# EAGLE design tix_display (EAGLE 7.3.0)
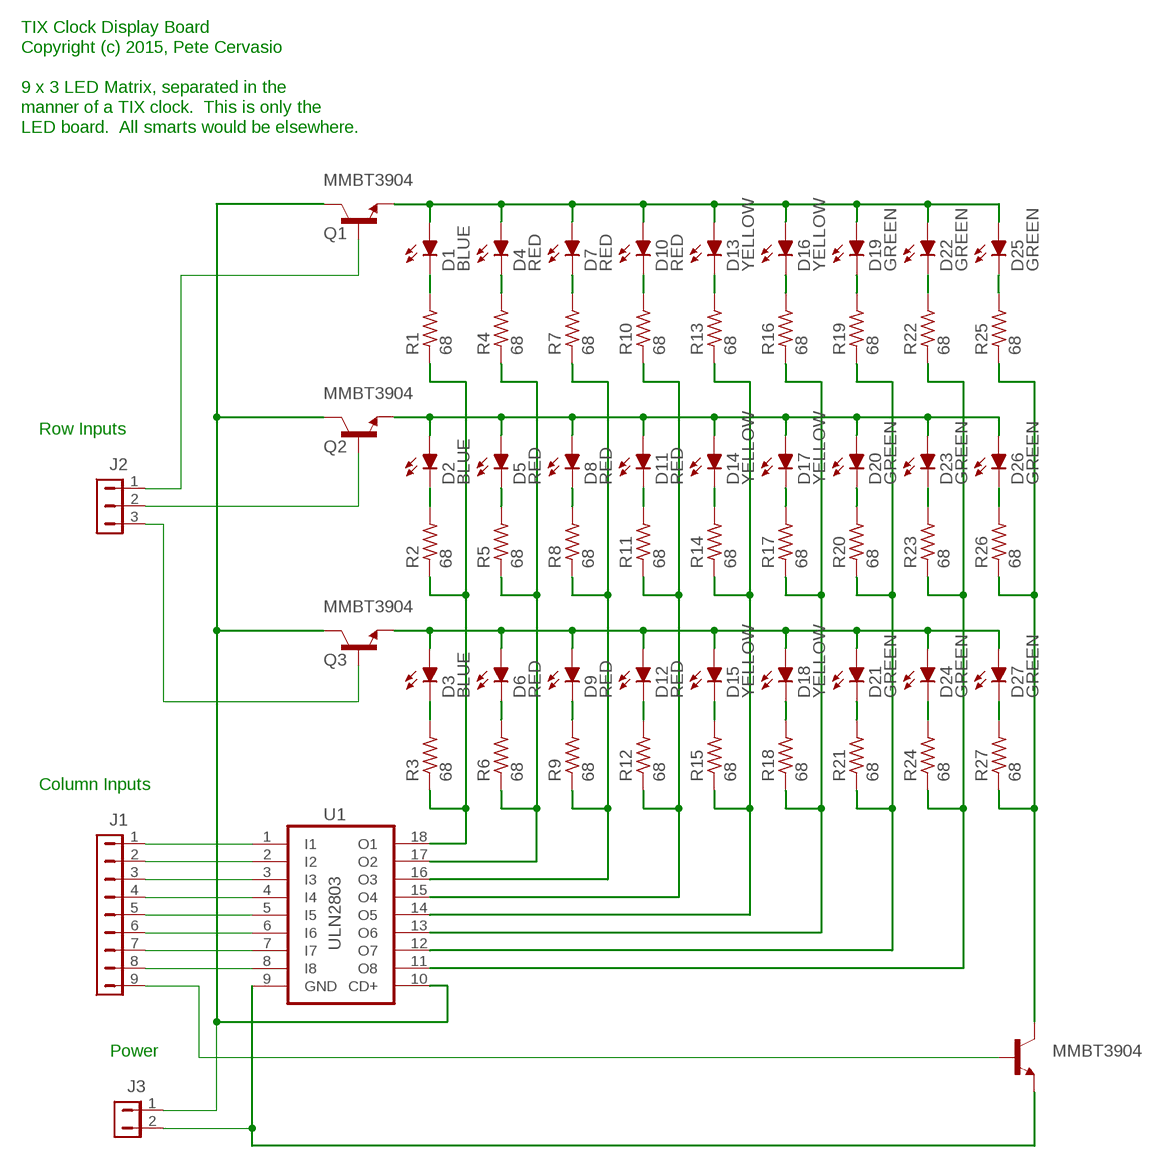
[diagram p0: schematic, sheet 1]

## Parts
D1  BLUE  AA2214SURSK  [AA2214SURSK]
D2  BLUE  AA2214SURSK  [AA2214SURSK]
D3  BLUE  AA2214SURSK  [AA2214SURSK]
D4  RED  AA2214SURSK  [AA2214SURSK]
D5  RED  AA2214SURSK  [AA2214SURSK]
D6  RED  AA2214SURSK  [AA2214SURSK]
D7  RED  AA2214SURSK  [AA2214SURSK]
D8  RED  AA2214SURSK  [AA2214SURSK]
D9  RED  AA2214SURSK  [AA2214SURSK]
D10  RED  AA2214SURSK  [AA2214SURSK]
D11  RED  AA2214SURSK  [AA2214SURSK]
D12  RED  AA2214SURSK  [AA2214SURSK]
D13  YELLOW  AA2214SURSK  [AA2214SURSK]
D14  YELLOW  AA2214SURSK  [AA2214SURSK]
D15  YELLOW  AA2214SURSK  [AA2214SURSK]
D16  YELLOW  AA2214SURSK  [AA2214SURSK]
D17  YELLOW  AA2214SURSK  [AA2214SURSK]
D18  YELLOW  AA2214SURSK  [AA2214SURSK]
D19  GREEN  AA2214SURSK  [AA2214SURSK]
D20  GREEN  AA2214SURSK  [AA2214SURSK]
D21  GREEN  AA2214SURSK  [AA2214SURSK]
D22  GREEN  AA2214SURSK  [AA2214SURSK]
D23  GREEN  AA2214SURSK  [AA2214SURSK]
D24  GREEN  AA2214SURSK  [AA2214SURSK]
D25  GREEN  AA2214SURSK  [AA2214SURSK]
D26  GREEN  AA2214SURSK  [AA2214SURSK]
D27  GREEN  AA2214SURSK  [AA2214SURSK]
J1  MTA09-100  [MTA09-100]
J2  MTA03-100  [MTA03-100]
J3  MTA02-100  [MTA02-100]
Q1  MMBT3904  [SOT23-BEC]
Q2  MMBT3904  [SOT23-BEC]
Q3  MMBT3904  [SOT23-BEC]
Q4  MMBT3904  [SOT23-BEC]
R1  68  R-US_M0805  [M0805]
R2  68  R-US_M0805  [M0805]
R3  68  R-US_M0805  [M0805]
R4  68  R-US_M0805  [M0805]
R5  68  R-US_M0805  [M0805]
R6  68  R-US_M0805  [M0805]
R7  68  R-US_M0805  [M0805]
R8  68  R-US_M0805  [M0805]
R9  68  R-US_M0805  [M0805]
R10  68  R-US_M0805  [M0805]
R11  68  R-US_M0805  [M0805]
R12  68  R-US_M0805  [M0805]
R13  68  R-US_M0805  [M0805]
R14  68  R-US_M0805  [M0805]
R15  68  R-US_M0805  [M0805]
R16  68  R-US_M0805  [M0805]
R17  68  R-US_M0805  [M0805]
R18  68  R-US_M0805  [M0805]
R19  68  R-US_M0805  [M0805]
R20  68  R-US_M0805  [M0805]
R21  68  R-US_M0805  [M0805]
R22  68  R-US_M0805  [M0805]
R23  68  R-US_M0805  [M0805]
R24  68  R-US_M0805  [M0805]
R25  68  R-US_M0805  [M0805]
R26  68  R-US_M0805  [M0805]
R27  68  R-US_M0805  [M0805]
U1  ULN2803  ULN2803AFW  [SO18W]

## Nets
GND: J3.2 Q4.E U1.9(GND)
LEDCOL1: R1.1 R2.1 R3.1 U1.18(O1)
LEDCOL2: R4.1 R5.1 R6.1 U1.17(O2)
LEDCOL3: R7.1 R8.1 R9.1 U1.16(O3)
LEDCOL4: R10.1 R11.1 R12.1 U1.15(O4)
LEDCOL5: R13.1 R14.1 R15.1 U1.14(O5)
LEDCOL6: R16.1 R17.1 R18.1 U1.13(O6)
LEDCOL7: R19.1 R20.1 R21.1 U1.12(O7)
LEDCOL8: R22.1 R23.1 R24.1 U1.11(O8)
LEDCOL9: Q4.C R25.1 R26.1 R27.1
N$1: D1.A D4.A D7.A D10.A D13.A D16.A D19.A D22.A D25.A Q1.E
N$2: D2.A D5.A D8.A D11.A D14.A D17.A D20.A D23.A D26.A Q2.E
N$3: D3.A D6.A D9.A D12.A D15.A D18.A D21.A D24.A D27.A Q3.E
N$13: D3.C R3.2
N$14: D27.C R27.2
N$15: J2.1 Q1.B
N$16: D24.C R24.2
N$17: J2.2 Q2.B
N$18: D21.C R21.2
N$19: D18.C R18.2
N$20: D15.C R15.2
N$21: D12.C R12.2
N$22: D9.C R9.2
N$23: D6.C R6.2
N$24: D2.C R2.2
N$25: D5.C R5.2
N$26: D8.C R8.2
N$27: D11.C R11.2
N$28: D14.C R14.2
N$29: D17.C R17.2
N$30: D20.C R20.2
N$31: D23.C R23.2
N$32: D26.C R26.2
N$33: D1.C R1.2
N$34: D25.C R25.2
N$35: D22.C R22.2
N$36: D19.C R19.2
N$37: D16.C R16.2
N$38: D13.C R13.2
N$39: D10.C R10.2
N$40: D7.C R7.2
N$41: D4.C R4.2
N$43: J2.3 Q3.B
N$44: J1.1 U1.1(I1)
N$45: J1.2 U1.2(I2)
N$46: J1.3 U1.3(I3)
N$47: J1.4 U1.4(I4)
N$48: J1.5 U1.5(I5)
N$49: J1.6 U1.6(I6)
N$50: J1.7 U1.7(I7)
N$51: J1.8 U1.8(I8)
N$52: J1.9 Q4.B
VCC: J3.1 Q1.C Q2.C Q3.C U1.10(CD+)

## Notes on the sheet
- TIX Clock Display Board
  Copyright (c) 2015, Pete Cervasio
  
  9 x 3 LED Matrix, separated in the
  manner of a TIX clock.  This is only the
  LED board.  All smarts would be elsewhere.
- Row Inputs
- Column Inputs
- Power

## Library data of the parts
D1-D27 = led:AA2214SURSK: SURFACE MOUNT LED
J1 = con-amp:MTA09: AMP connector
J2 = con-amp:MTA03: AMP connector
J3 = con-amp:MTA02: AMP connector
Q1-Q4 = transistor-npn:MMBT3904*: NPN TRANSISTOR
R1-R27 = rcl:R-US_: RESISTOR, American symbol
U1 = uln-udn:ULN2803A: DRIVER ARRAY

## Board
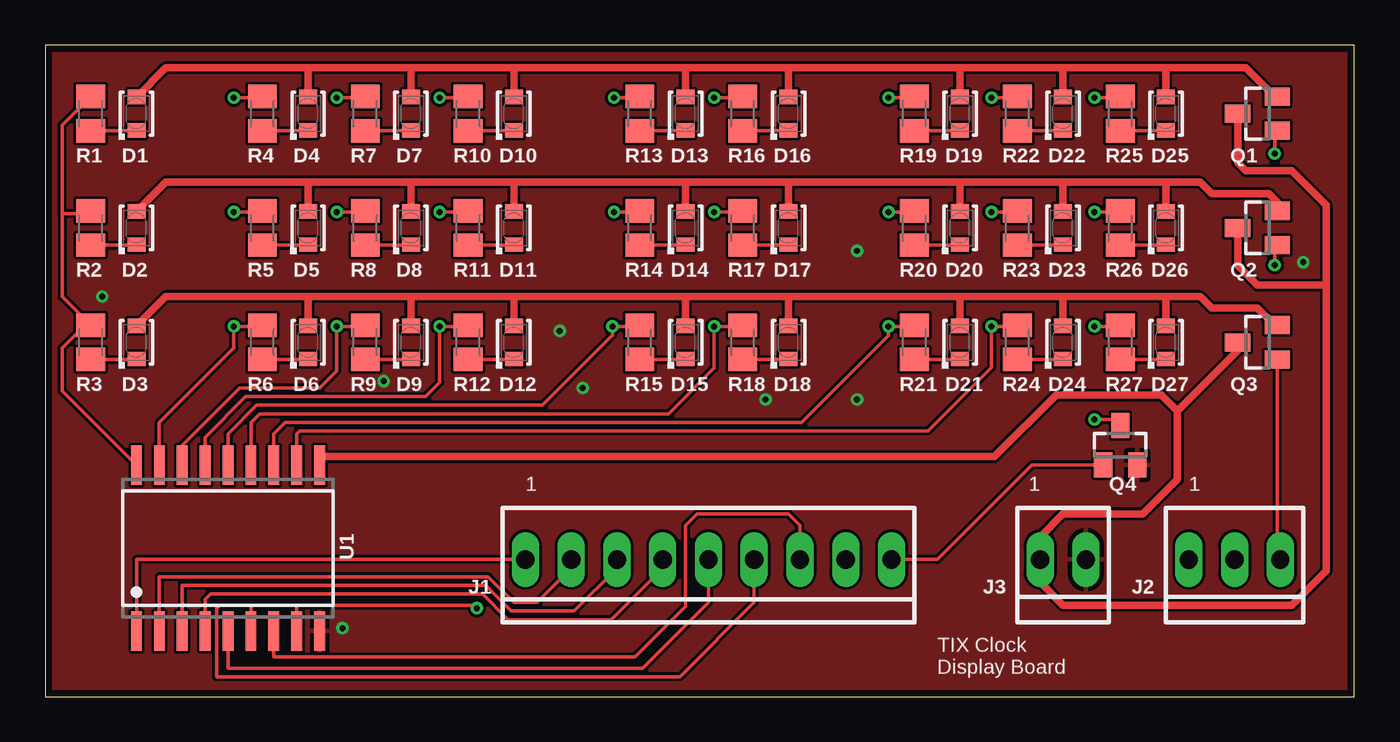
[diagram p1: board, top side]
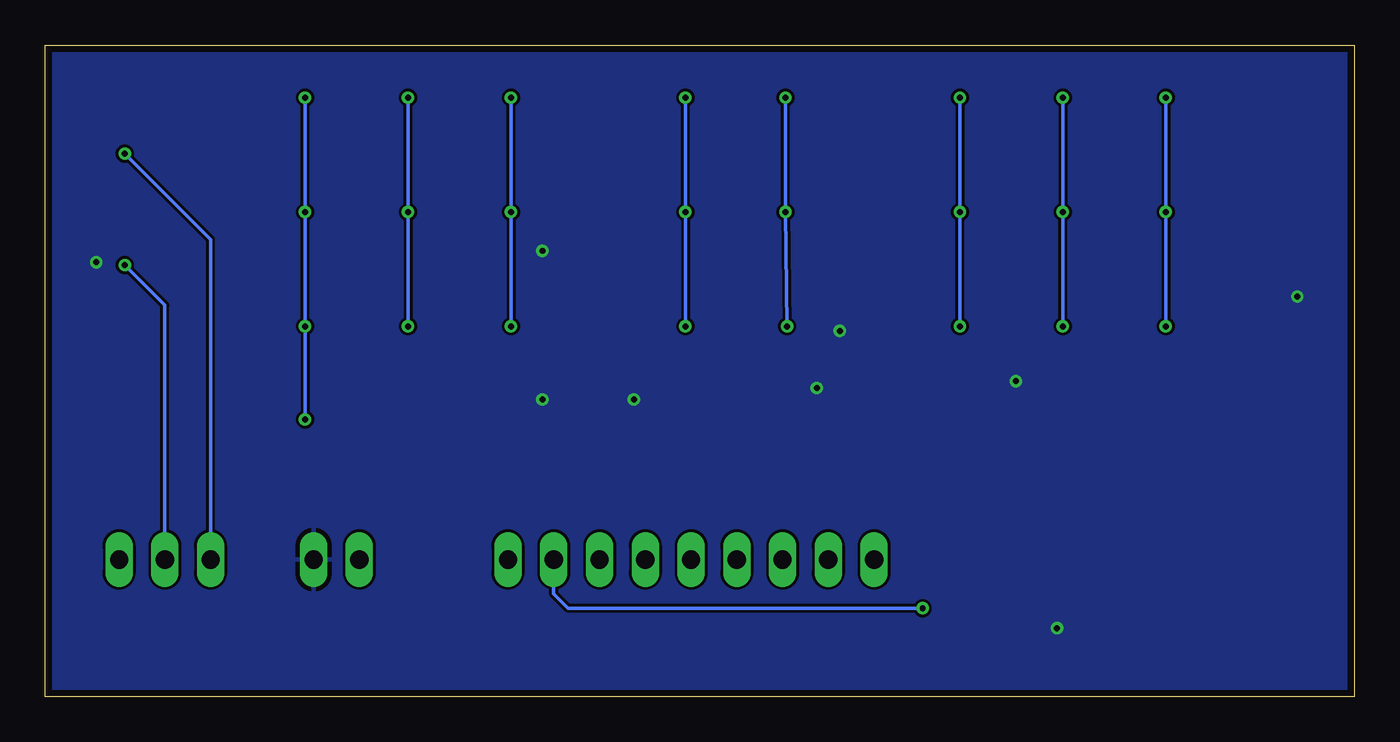
[diagram p2: board, bottom side, seen from below]

Size 72.69 x 36.2 mm. Coordinates in mm from the lower left corner, seen from the top.
Outline: 0,0 72.69,0 72.69,36.19 0,36.2 0,0
Copper layers (1*16): Top 0.0356mm / dielectric 1.5011mm / Bottom 0.0356mm
Design rules "LaenPCBOrder": minimum track width 6mil, minimum drill 13mil, track to track 6mil, track to pad 6mil, pad to pad 6mil, via to via 6mil, smd to smd 6mil, copper to edge 15mil, drill to drill 6mil, minimum pad ring 7mil, minimum via ring 7mil, stop-mask expansion 3mil, vias tented up to drill 0mil, thermal gap 10mil

### Footprints (pad centres in the part's own frame; a part is rotated, then mirrored left to right if it is on the bottom)
AA2214SURSK = smd 0.8 x 1: A -0.925,0; C 0.925,0
MTA09-100 = drill 1.016 long: 1 10.16,0; 2 7.62,0; 3 5.08,0; 4 2.54,0; 5 0,0; 6 -2.54,0; 7 -5.08,0; 8 -7.62,0; 9 -10.16,0
MTA03-100 = drill 1.016 long: 1 2.54,0; 2 0,0; 3 -2.54,0
MTA02-100 = drill 1.016 long: 1 1.27,0; 2 -1.27,0
SOT23-BEC = smd 1 x 1.4: B -0.95,-1.1; C 0,1.1; E 0.95,-1.1
M0805 = smd 1.3 x 1.6: 1 -0.95,0; 2 0.95,0
SO18W = smd 0.6 x 2.2: 1 -5.08,-4.6; 2 -3.81,-4.6; 3 -2.54,-4.6; 4 -1.27,-4.6; 5 0,-4.6; 6 1.27,-4.6; 7 2.54,-4.6; 8 3.81,-4.6; 9 5.08,-4.6; 10 5.08,4.6; 11 3.81,4.6; 12 2.54,4.6; 13 1.27,4.6; 14 0,4.6; 15 -1.27,4.6; 16 -2.54,4.6; 17 -3.81,4.6; 18 -5.08,4.6

### Placement (x,y rotation side)
D1  5.08,32.38 270 top
D2  5.08,26.04 270 top
D3  5.08,19.68 270 top
D4  14.61,32.38 270 top
D5  14.61,26.04 270 top
D6  14.61,19.68 270 top
D7  20.32,32.38 270 top
D8  20.32,26.04 270 top
D9  20.32,19.68 270 top
D10  26.04,32.38 270 top
D11  26.04,26.04 270 top
D12  26.04,19.68 270 top
D13  35.56,32.38 270 top
D14  35.56,26.04 270 top
D15  35.56,19.68 270 top
D16  41.27,32.38 270 top
D17  41.27,26.04 270 top
D18  41.27,19.68 270 top
D19  50.8,32.38 270 top
D20  50.8,26.04 270 top
D21  50.8,19.68 270 top
D22  56.52,32.38 270 top
D23  56.52,26.04 270 top
D24  56.52,19.68 270 top
D25  62.23,32.38 270 top
D26  62.23,26.04 270 top
D27  62.23,19.68 270 top
J1  36.83,7.62 180 top
J2  66.04,7.62 180 top
J3  56.52,7.62 180 top
Q1  67.31,32.38 90 top
Q2  67.31,26.04 90 top
Q3  67.31,19.68 90 top
Q4  59.69,13.97 0 top
R1  2.54,32.38 270 top
R2  2.54,26.04 270 top
R3  2.54,19.68 270 top
R4  12.06,32.38 270 top
R5  12.06,26.04 270 top
R6  12.06,19.68 270 top
R7  17.78,32.38 270 top
R8  17.78,26.04 270 top
R9  17.78,19.68 270 top
R10  23.5,32.38 270 top
R11  23.5,26.04 270 top
R12  23.5,19.68 270 top
R13  33.02,32.38 270 top
R14  33.02,26.04 270 top
R15  33.02,19.68 270 top
R16  38.73,32.38 270 top
R17  38.73,26.04 270 top
R18  38.73,19.68 270 top
R19  48.26,32.38 270 top
R20  48.26,26.04 270 top
R21  48.26,19.68 270 top
R22  53.98,32.38 270 top
R23  53.98,26.04 270 top
R24  53.98,19.68 270 top
R25  59.69,32.38 270 top
R26  59.69,26.04 270 top
R27  59.69,19.68 270 top
U1  10.16,8.26 0 top

### Tracks (layer width: path | path; a pad name or v marks a point on that pad's centre or on a via)
GND  (via drill 0.33)
  other vias: 16.51,3.81 45.09,16.51 45.09,24.77 69.85,24.13 40.01,16.51 29.84,17.14 28.57,20.32 3.17,22.23 18.8,17.53
  pour Bottom: 0,36.2 72.39,36.2 72.39,0 0,0
  pour Top: 0,36.2 72.39,36.2 72.39,0 0,0
LEDCOL1
  Top 0.203: 0.95,26.83 0.95,22.23 R3.1 | 0.95,26.83 2.54,26.83 R2.1 | 0.95,26.83 0.95,31.75 R1.1 2.54,33.18 | U1.18 0.95,16.99 0.95,19.37 1.91,20.32 2.23,20.32 R3.1 | 2.54,20.48 R3.1
LEDCOL2  (via drill 0.33)
  Top 0.203: U1.17 6.35,15.24 10.48,19.37 v10.48,20.57 11.68,20.57 R6.1 11.75,20.32 | v10.48,33.27 11.43,33.27 R4.1 | v10.48,26.92 11.43,26.92 R5.1
  Bottom 0.203: v10.48,33.27 v10.48,26.92 v10.48,20.57
LEDCOL3  (via drill 0.33)
  Top 0.203: 17.62,27.15 R8.1 | 17.78,33.18 R7.1 17.27,33.27 v16.19,33.27 | 17.78,20.48 R9.1 | R9.1 | 17.72,26.92 R8.1 | U1.16 7.62,13.97 10.79,17.14 15.24,17.14 16.19,18.1 v16.19,20.57 17.27,20.57 R9.1 | v16.19,26.92 17.27,26.92 R8.1
  Bottom 0.203: v16.19,33.27 v16.19,26.92 v16.19,20.57
LEDCOL4  (via drill 0.33)
  Top 0.203: 23.34,27.15 R11.1 23.43,26.92 v21.91,26.92 | U1.15 8.89,14.41 11.14,16.67 21.11,16.67 21.91,17.46 v21.91,20.57 22.86,20.57 R12.1 | 23.5,20.48 R12.1 | R12.1 | v21.91,33.27 23.11,33.27 R10.1
  Bottom 0.203: v21.91,33.27 v21.91,26.92 v21.91,20.57
LEDCOL5  (via drill 0.33)
  Top 0.203: R15.1 32.51,20.57 v31.5,20.57 31.5,20.07 31.49,20.07 27.62,16.19 11.75,16.19 10.16,14.61 U1.14 | 33.02,33.18 R13.1 32.51,33.27 v31.59,33.27 | v31.59,26.92 32.51,26.92 R14.1
  Bottom 0.203: v31.5,20.57 v31.59,26.92 v31.59,33.27
LEDCOL6  (via drill 0.33)
  Top 0.203: R18.1 38.1,20.57 v37.15,20.57 37.15,18.26 34.61,15.72 11.91,15.72 11.43,15.24 U1.13 | v37.15,33.27 38.1,33.27 R16.1 | v37.15,26.92 38.1,26.92 R17.1
  Bottom 0.203: v37.15,20.57 v37.15,26.92 v37.15,33.27
LEDCOL7  (via drill 0.33)
  Top 0.203: R21.1 47.75,20.57 v46.83,20.57 46.83,20.07 42.01,15.24 13.34,15.24 12.7,14.61 U1.12 | v46.83,33.27 47.75,33.27 R19.1 | v46.83,26.92 47.75,26.92 R20.1
  Bottom 0.203: v46.83,20.57 v46.83,26.92 v46.83,33.27
LEDCOL8  (via drill 0.33)
  Top 0.203: 53.66,20.95 R24.1 53.34,20.57 v52.55,20.57 52.55,18.29 49.02,14.76 14.13,14.76 13.97,14.61 U1.11 | v52.55,33.27 53.34,33.27 R22.1 | v52.55,26.92 53.34,26.92 R23.1
  Bottom 0.203: v52.55,20.57 v52.55,26.92 v52.55,33.27
LEDCOL9  (via drill 0.33)
  Top 0.203: v58.26,15.4 59.37,15.4 Q4.C | 59.69,20.48 R27.1 58.93,20.57 v58.26,20.57 | 59.69,26.83 R26.1 59.18,26.92 v58.26,26.92 | 59.69,33.18 R25.1 59.18,33.27 v58.26,33.27
  Bottom 0.203: v58.26,15.4 v58.26,20.57 v58.26,26.92 v58.26,33.27
N$1
  Top 0.203: 5.08,33.34 D1.A | 14.61,33.34 D4.A | 20.32,33.34 D7.A | 26.04,33.34 D10.A
  Top 0.406: Q1.E 68.27,33.34 66.67,34.92 62.23,34.92 | 62.23,34.92 56.52,34.92 | 56.52,34.92 50.8,34.92 | 50.8,34.92 41.27,34.92 | 41.27,34.92 35.56,34.92 | 35.56,34.92 26.04,34.92 | 26.04,34.92 20.32,34.92 | 20.32,34.92 14.61,34.92 | 14.61,34.92 6.7,34.92 D1.A | D4.A 14.61,34.92 | D7.A 20.32,34.92 | D10.A 26.04,34.92 | D13.A 35.56,34.92 | D16.A 41.27,34.92 | D19.A 50.8,34.92 | D22.A 56.52,34.92 | D25.A 62.23,34.92
N$2
  Top 0.406: 62.23,28.57 64.14,28.57 64.77,27.94 67.94,27.94 68.41,27.48 Q2.E | 62.23,28.57 56.52,28.57 | 56.52,28.57 50.8,28.57 | 50.8,28.57 41.27,28.57 | D26.A 62.23,28.57 | D23.A 56.52,28.57 | D20.A 50.8,28.57 | D17.A 41.27,28.57 | 41.27,28.57 35.56,28.57 | 35.56,28.57 26.04,28.57 | 26.04,28.57 20.32,28.57 | 20.32,28.57 14.61,28.57 | 14.61,28.57 6.7,28.57 D2.A | D14.A 35.56,28.57 | D11.A 26.04,28.57 | D8.A 20.32,28.57 | D5.A 14.61,28.57
N$3
  Top 0.203: 35.56,20.64 D15.A
  Top 0.406: Q3.E 68.27,20.64 67.31,21.59 64.77,21.59 64.14,22.23 62.23,22.23 | 62.23,22.23 56.52,22.23 | 56.52,22.23 50.8,22.23 | 50.8,22.23 41.27,22.23 | 41.27,22.23 35.56,22.23 | 35.56,22.23 26.04,22.23 | 26.04,22.23 20.32,22.23 | 20.32,22.23 14.61,22.23 | 14.61,22.23 6.7,22.23 D3.A | D6.A 14.61,22.23 | D9.A 20.32,22.23 | D12.A 26.04,22.23 | D15.A 35.56,22.23 | D18.A 41.27,22.23 | D21.A 50.8,22.23 | D24.A 56.52,22.23 | D27.A 62.23,22.23
N$13
  Top 0.203: D3.C 5.08,18.73 R3.2
N$14
  Top 0.203: D27.C 62.23,18.73 R27.2
N$15  (via drill 0.33)
  Top 0.203: v68.26,30.16 68.26,31.43 Q1.B
  Bottom 0.203: v68.26,30.16 63.5,25.4 J2.1
N$16
  Top 0.203: D24.C 56.52,18.73 R24.2
N$17  (via drill 0.33)
  Top 0.203: v68.26,23.97 68.26,25.08 Q2.B
  Bottom 0.203: v68.26,23.97 66.04,21.75 J2.2
N$18
  Top 0.203: D21.C 50.8,18.73 R21.2
N$19
  Top 0.203: D18.C 41.27,18.73 R18.2
N$20
  Top 0.203: D15.C 35.56,18.73 R15.2
N$21
  Top 0.203: D12.C 26.04,18.73 R12.2
N$22
  Top 0.203: D9.C 20.32,18.73 R9.2
N$23
  Top 0.203: D6.C 14.61,18.73 R6.2
N$24
  Top 0.203: D2.C 5.08,25.08 R2.2
N$25
  Top 0.203: D5.C 14.61,25.08 R5.2
N$26
  Top 0.203: D8.C 20.32,25.08 R8.2
N$27
  Top 0.203: D11.C 26.04,25.08 R11.2
N$28
  Top 0.203: D14.C 35.56,25.08 R14.2
N$29
  Top 0.203: D17.C 41.27,25.08 R17.2
N$30
  Top 0.203: D20.C 50.8,25.08 R20.2
N$31
  Top 0.203: D23.C 56.52,25.08 R23.2
N$32
  Top 0.203: D26.C 62.23,25.08 R26.2
N$33
  Top 0.203: D1.C 5.08,31.43 R1.2
N$34
  Top 0.203: D25.C 62.23,31.43 R25.2
N$35
  Top 0.203: D22.C 56.52,31.43 R22.2
N$36
  Top 0.203: D19.C 50.8,31.43 R19.2
N$37
  Top 0.203: D16.C 41.27,31.43 R16.2
N$38
  Top 0.203: D13.C 35.56,31.43 R13.2
N$39
  Top 0.203: D10.C 26.04,31.43 R10.2
N$40
  Top 0.203: D7.C 20.32,31.43 R7.2
N$41
  Top 0.203: D4.C 14.61,31.43 R4.2
N$43
  Top 0.203: J2.3 68.42,7.62 68.42,18.73 Q3.B
N$44
  Top 0.203: U1.1 5.08,7.62 J1.1
N$45
  Top 0.203: U1.2 6.35,6.67 24.61,6.67 26.04,5.24 27.3,5.24 29.21,7.14 J1.2
N$46
  Top 0.203: U1.3 7.62,6.19 24.45,6.19 25.88,4.76 29.37,4.76 31.75,7.14 J1.3
N$47
  Top 0.203: U1.4 8.89,5.4 9.21,5.71 24.29,5.71 25.72,4.29 31.43,4.29 34.29,7.14 J1.4
N$48
  Top 0.203: U1.5 10.16,1.59 33.18,1.59 36.83,5.24 J1.5
N$49
  Top 0.203: U1.6 11.43,5.08 9.68,5.08 9.53,4.92 9.53,1.11 35.24,1.11 39.37,5.24 J1.6
N$50
  Top 0.203: U1.7 12.7,2.22 32.77,2.22 35.56,5.02 35.56,9.53 36.2,10.16 41.27,10.16 41.91,9.53 J1.7
N$51  (via drill 0.33)
  Top 0.203: U1.8 13.97,5.08 23.81,5.08 v23.97,4.92
  Bottom 0.203: v23.97,4.92 43.66,4.92 44.45,5.71 J1.8
N$52
  Top 0.203: Q4.B 54.78,12.87 49.53,7.62 J1.9
VCC
  Top 0.203: 15.24,12.06 U1.10 | 66.2,19.68 Q3.C
  Top 0.406: Q1.C 66.21,29.68 66.67,29.21 69.22,29.21 71.12,27.3 71.12,22.86 | 71.12,22.86 71.12,6.99 69.22,5.08 56.52,5.08 55.24,6.35 J3.1 55.24,8.89 56.52,10.16 60.96,10.16 62.87,12.06 62.87,15.88 | Q2.C 66.21,23.96 67.31,22.86 71.12,22.86 | Q3.C 66.21,19.22 62.87,15.88 | 15.24,12.06 15.24,13.34 52.7,13.34 56.13,16.76 61.98,16.76 62.87,15.88

### Text on the board
tNames: 1 | 1 | 1 | TIX Clock / Display Board